# Altium schematic sheet SAFETY_SWITCH.SchDoc
size B; SheetNumber: 4; SheetTotal: 10
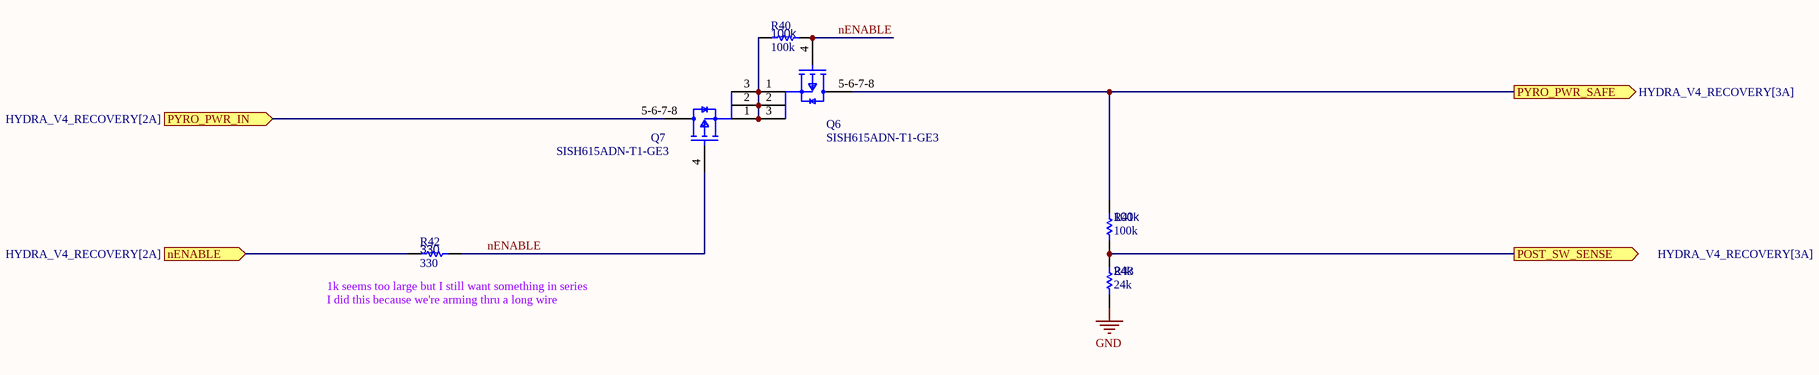
[diagram p0: SAFETY_SWITCH.SchDoc]

## Parts
Q6  SISH615ADN-T1-GE3  [SISH615ADN-T1-GE3-Footprint-1]
Q7  SISH615ADN-T1-GE3  [SISH615ADN-T1-GE3-Footprint-1]
R40  100k  [R0603B]
R41  100k  [R0603B]
R42  330  [R0603B]
R43  24k  [R0603B]

## Ports
nENABLE (in, see HYDRA_V4_RECOVERY[2A]), POST_SW_SENSE (out, see HYDRA_V4_RECOVERY[3A]), PYRO_PWR_IN (in, see HYDRA_V4_RECOVERY[2A]), PYRO_PWR_SAFE (out, see HYDRA_V4_RECOVERY[3A])

## Nets
GND: R43.1
nENABLE: Q6.4(G) Q7.4(G) R40.2 R42.1
nENABLE: R42.2 ; port nENABLE  [a separate net that carries the same name]
POST_SW_SENSE: R41.1 R43.2 ; port POST_SW_SENSE
PYRO_PWR_IN: Q7.5-6-7-8(D) ; port PYRO_PWR_IN
PYRO_PWR_SAFE: Q6.5-6-7-8(D) R41.2 ; port PYRO_PWR_SAFE
NetQ6_1: Q6.1(S) Q6.2(S) Q6.3(S) Q7.1(S) Q7.2(S) Q7.3(S) R40.1

## Notes on the sheet
- (near R42) 1k seems too large but I still want something in series
- (near R42) I did this because we're arming thru a long wire

## Library data of the parts
Q6 Q7 = CMP-013-00018-2: Trans MOSFET P-CH 20V 22.1A 8-Pin PowerPAK 1212 EP T/R; Source: SISH615ADN-T1-GE3.SchLib; Design Item ID: CMP-013-00036-4; Component Type: Standard; Pins: 5
R40-R43 = CMP-009-00002-14: Resistor
  R40 R41: Value: 100k
  R42: Value: 330
  R43: Value: 24k